# Altium schematic sheet Main_Board.SchDoc
size A; SheetNumber: 1; SheetTotal: 6
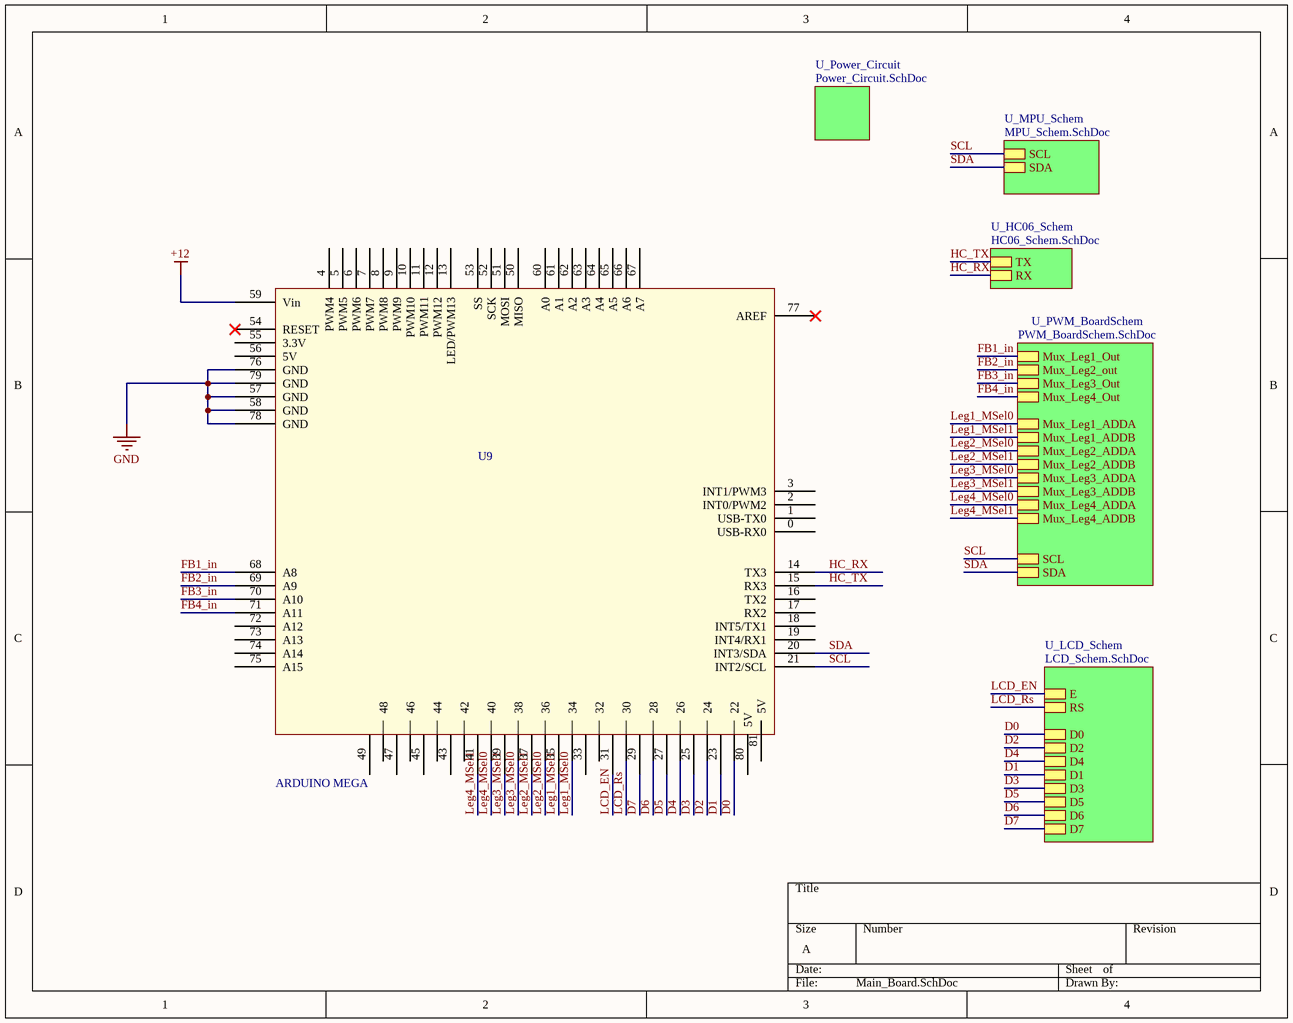
[diagram p0: Main_Board.SchDoc]

## Parts
U9  ARDUINO MEGA  [ARDUINO MEGA]

## Sub-sheets
U_HC06_Schem = HC06_Schem.SchDoc: TX, RX
U_LCD_Schem = LCD_Schem.SchDoc: E, RS, D0, D2, D4, D1, D3, D5, D6, D7
U_MPU_Schem = MPU_Schem.SchDoc: SCL, SDA
U_Power_Circuit = Power_Circuit.SchDoc: no entries
U_PWM_BoardSchem = PWM_BoardSchem.SchDoc: SCL, SDA, Mux_Leg2_ADDB, Mux_Leg4_Out, Mux_Leg3_ADDB, Mux_Leg2_ADDA, Mux_Leg3_ADDA, Mux_Leg1_ADDB, Mux_Leg4_ADDA, Mux_Leg4_ADDB, Mux_Leg3_Out, Mux_Leg1_Out, Mux_Leg1_ADDA, Mux_Leg2_out

## Nets
+12: U9.59(Vin)
GND: U9.57(GND) U9.58(GND) U9.76(GND) U9.78(GND) U9.79(GND)
D0: U9.22 ; sheet U_LCD_Schem/D0
D1: U9.23 ; sheet U_LCD_Schem/D1
D2: U9.24 ; sheet U_LCD_Schem/D2
D3: U9.25 ; sheet U_LCD_Schem/D3
D4: U9.26 ; sheet U_LCD_Schem/D4
D5: U9.27 ; sheet U_LCD_Schem/D5
D6: U9.28 ; sheet U_LCD_Schem/D6
D7: U9.29 ; sheet U_LCD_Schem/D7
FB1_in: U9.68(A8) ; sheet U_PWM_BoardSchem/Mux_Leg1_Out
FB2_in: U9.69(A9) ; sheet U_PWM_BoardSchem/Mux_Leg2_out
FB3_in: U9.70(A10) ; sheet U_PWM_BoardSchem/Mux_Leg3_Out
FB4_in: U9.71(A11) ; sheet U_PWM_BoardSchem/Mux_Leg4_Out
HC_RX: U9.14(TX3) ; sheet U_HC06_Schem/RX
HC_TX: U9.15(RX3) ; sheet U_HC06_Schem/TX
LCD_EN: U9.31 ; sheet U_LCD_Schem/E
LCD_Rs: U9.30 ; sheet U_LCD_Schem/RS
Leg1_MSel0: U9.34 ; sheet U_PWM_BoardSchem/Mux_Leg1_ADDA
Leg1_MSel1: U9.35 ; sheet U_PWM_BoardSchem/Mux_Leg1_ADDB
Leg2_MSel0: U9.36 ; sheet U_PWM_BoardSchem/Mux_Leg2_ADDA
Leg2_MSel1: U9.37 ; sheet U_PWM_BoardSchem/Mux_Leg2_ADDB
Leg3_MSel0: U9.38 ; sheet U_PWM_BoardSchem/Mux_Leg3_ADDA
Leg3_MSel1: U9.39 ; sheet U_PWM_BoardSchem/Mux_Leg3_ADDB
Leg4_MSel0: U9.40 ; sheet U_PWM_BoardSchem/Mux_Leg4_ADDA
Leg4_MSel1: U9.41 ; sheet U_PWM_BoardSchem/Mux_Leg4_ADDB
SCL: U9.21(INT2/SCL) ; sheet U_MPU_Schem/SCL, sheet U_PWM_BoardSchem/SCL
SDA: U9.20(INT3/SDA) ; sheet U_MPU_Schem/SDA, sheet U_PWM_BoardSchem/SDA

Not connected (* = marked no-connect by the designer): U9 0(USB-RX0) 1(USB-TX0) 2(INT0/PWM2) 3(INT1/PWM3) 4(PWM4) 5(PWM5) 6(PWM6) 7(PWM7) 8(PWM8) 9(PWM9) 10(PWM10) 11(PWM11) 12(PWM12) 13(LED/PWM13) 16(TX2) 17(RX2) 18(INT5/TX1) 19(INT4/RX1) 32 33 42 43 44 45 46 47 48 49 50(MISO) 51(MOSI) 52(SCK) 53(SS) 54(RESET)* 55(3.3V) 56(5V) 60(A0) 61(A1) 62(A2) 63(A3) 64(A4) 65(A5) 66(A6) 67(A7) 72(A12) 73(A13) 74(A14) 75(A15) 77(AREF)* 80(5V) 81(5V)